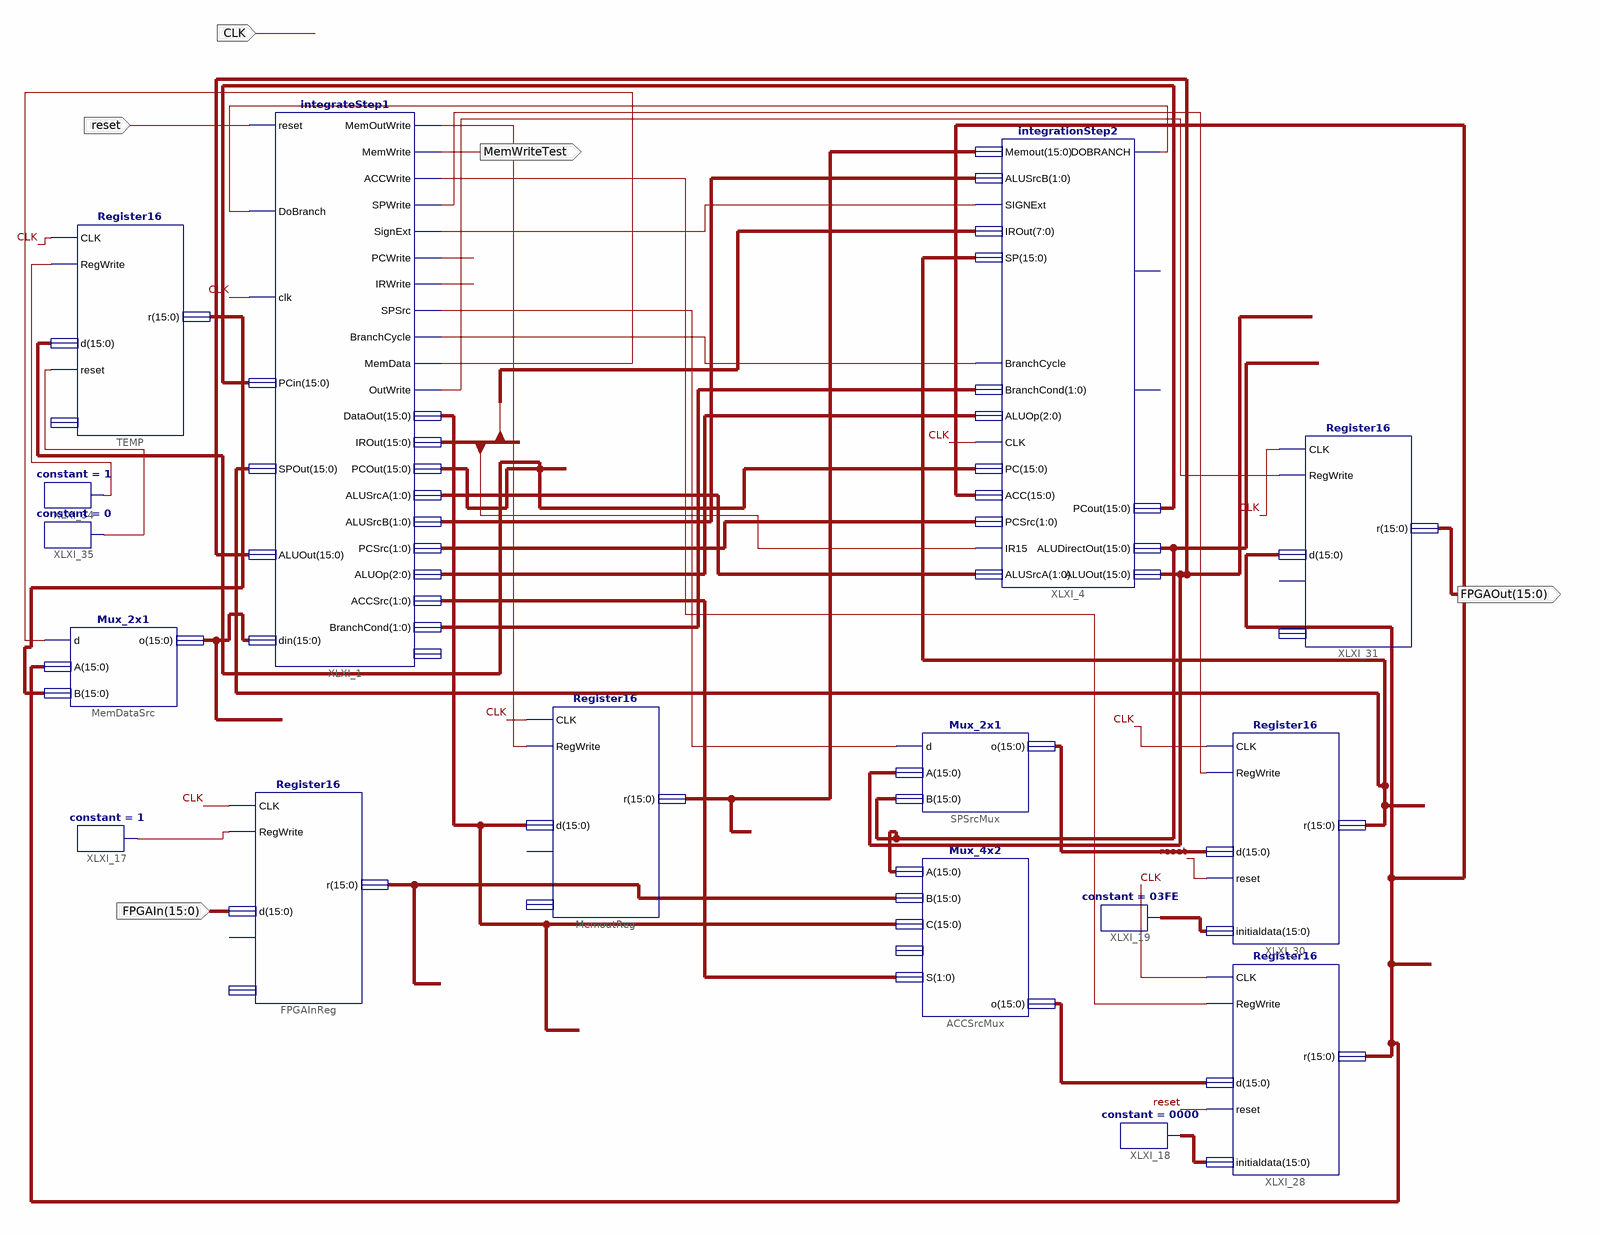
[diagram p0: schematic sheet 1]
// Xilinx ISE schematic integration3.sch (spartan3e) as structural Verilog: 16 symbols, 5 ports
module integration3 (
  input  CLK,
  input  [15:0] FPGAIn,
  input  reset,
  output [15:0] FPGAOut,
  output MemWriteTest
);

  wire IRWriteTest, PCWriteTest, XLXN_11, XLXN_18, XLXN_26, XLXN_32, XLXN_36, XLXN_48, XLXN_50, XLXN_51,
       XLXN_54, XLXN_98, XLXN_100, XLXN_105;
  wire [1:0] XLXN_6, XLXN_8, XLXN_12, XLXN_19, XLXN_37;
  wire [2:0] XLXN_9;
  wire [15:0] ACCTest, ALUDirectOutTest, ALUOutTest, DataOut, InTest, IROutBranch, MeminTest, MemoutTest,
       PCOutTest, SPTest, XLXN_42, XLXN_43, XLXN_59, XLXN_83, XLXN_84, XLXN_108;

  integrateStep1 XLXI_1 (
    .reset(reset), .DoBranch(XLXN_98), .clk(CLK), .PCin(XLXN_59), .SPOut(SPTest), .ALUOut(ALUOutTest),
    .din(MeminTest), .MemOutWrite(XLXN_32), .MemWrite(MemWriteTest), .ACCWrite(XLXN_50), .SPWrite(XLXN_51),
    .SignExt(XLXN_11), .PCWrite(PCWriteTest), .IRWrite(IRWriteTest), .SPSrc(XLXN_36), .BranchCycle(XLXN_18),
    .MemData(XLXN_26), .OutWrite(XLXN_54), .DataOut(DataOut), .IROut(IROutBranch), .PCOut(PCOutTest),
    .ALUSrcA(XLXN_6), .ALUSrcB(XLXN_12), .PCSrc(XLXN_8), .ALUOp(XLXN_9), .ACCSrc(XLXN_37),
    .BranchCond(XLXN_19));  // open: MemAddr
  integrationStep2 XLXI_4 (
    .Memout(MemoutTest), .ALUSrcB(XLXN_12), .SIGNExt(XLXN_11), .IROut(IROutBranch[7:0]), .SP(SPTest),
    .IR15(IROutBranch[15]), .BranchCycle(XLXN_18), .BranchCond(XLXN_19), .ALUOp(XLXN_9), .CLK(CLK),
    .PC(PCOutTest), .ACC(ACCTest), .PCSrc(XLXN_8), .ALUSrcA(XLXN_6), .DOBRANCH(XLXN_98),
    .ALUDirectOut(ALUDirectOutTest), .PCout(XLXN_59), .ALUOut(ALUOutTest));  // open: Zero, ovfl
  Mux_2x1 MemDataSrc (.d(XLXN_26), .A(ACCTest), .B(XLXN_108), .o(MeminTest));
  Register16 MemoutReg (.CLK(CLK), .RegWrite(XLXN_32), .d(DataOut), .r(MemoutTest));  // open: reset, initialdata
  Mux_2x1 SPSrcMux (.d(XLXN_36), .A(ALUOutTest), .B(ALUDirectOutTest), .o(XLXN_42));
  Mux_4x2 ACCSrcMux (.A(ALUDirectOutTest), .B(InTest), .C(DataOut), .S(XLXN_37), .o(XLXN_43));  // open: D
  Register16 FPGAInReg (.CLK(CLK), .RegWrite(XLXN_48), .d(FPGAIn), .r(InTest));  // open: reset, initialdata
  constant #(.CValue("1")) XLXI_17 (.O(XLXN_48));
  constant #(.CValue("0000")) XLXI_18 (.O(XLXN_84));
  constant #(.CValue("03FE")) XLXI_19 (.O(XLXN_83));
  Register16 XLXI_28 (.reset(reset), .CLK(CLK), .RegWrite(XLXN_50), .d(XLXN_43), .initialdata(XLXN_84), .r(ACCTest));
  Register16 XLXI_30 (.reset(reset), .CLK(CLK), .RegWrite(XLXN_51), .d(XLXN_42), .initialdata(XLXN_83), .r(SPTest));
  Register16 TEMP (.reset(XLXN_105), .CLK(CLK), .RegWrite(XLXN_100), .d(PCOutTest), .r(XLXN_108));  // open: initialdata
  constant #(.CValue("1")) XLXI_34 (.O(XLXN_100));
  constant #(.CValue("0")) XLXI_35 (.O(XLXN_105));
  Register16 XLXI_31 (.CLK(CLK), .RegWrite(XLXN_54), .d(ACCTest), .r(FPGAOut));  // open: reset, initialdata
endmodule
